# EAGLE design LED (EAGLE 6.1)
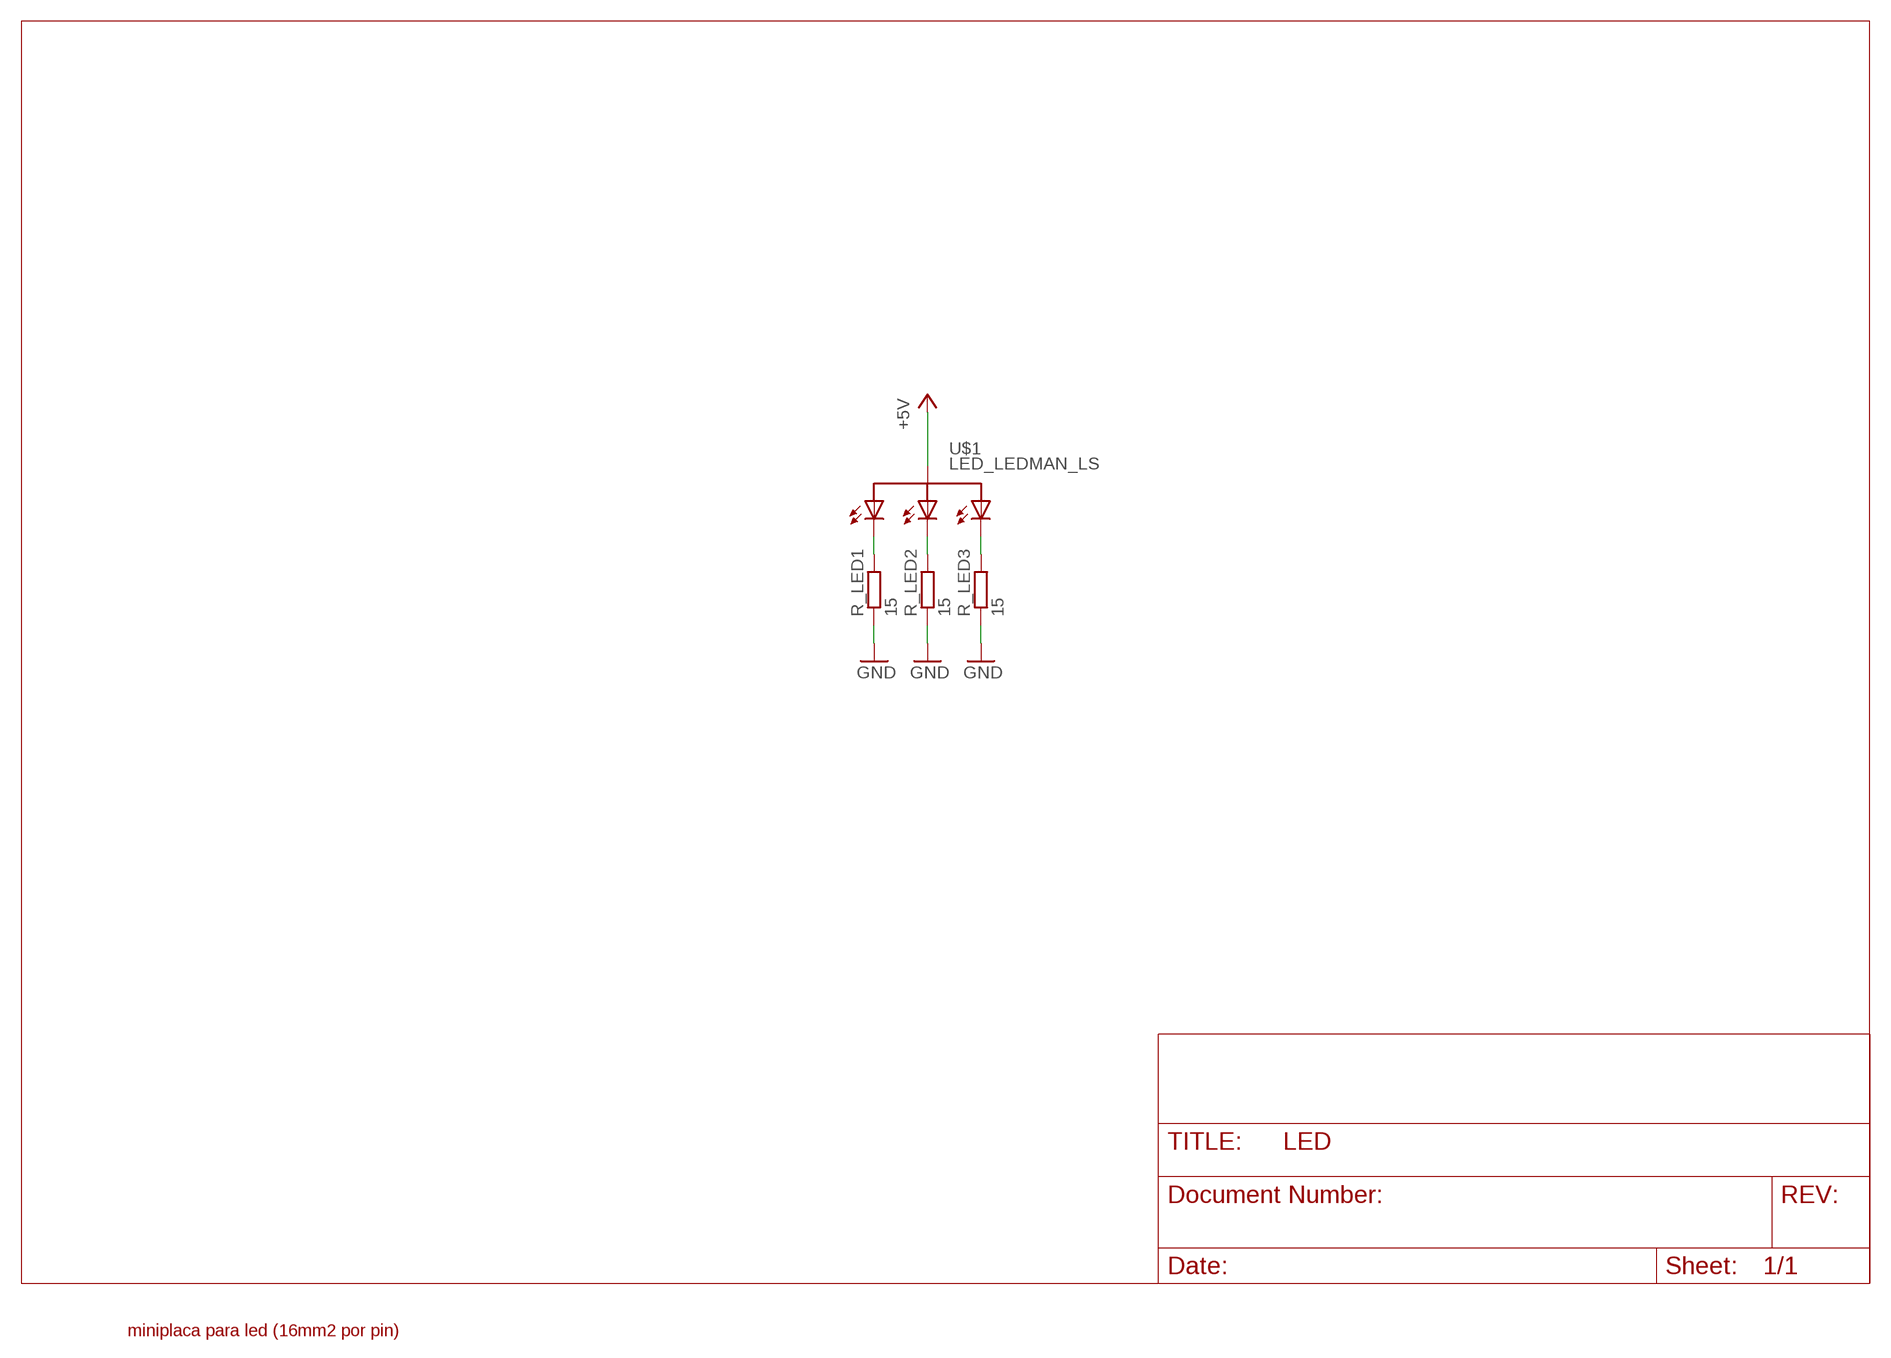
[diagram p0: schematic, sheet 1]

## Parts
R_LED1  15  R-EU_R1206  [R1206]
R_LED2  15  R-EU_R1206  [R1206]
R_LED3  15  R-EU_R1206  [R1206]
U$1  LED_LEDMAN_LS  [LED_LEDMAN_LS]

## Nets
+5V: U$1.2(ANODO)
GND: R_LED1.1 R_LED2.1 R_LED3.1
N$1: R_LED1.2 U$1.1(C1)
N$2: R_LED2.2 U$1.3(C2)
N$3: R_LED3.2 U$1.4(C3)

## Notes on the sheet
- miniplaca para led (16mm2 por pin)

## Library data of the parts
R_LED1-R_LED3 = rcl:R-EU_: RESISTOR, European symbol
U$1 = dan:LED_LEDMAN_LS

## Board
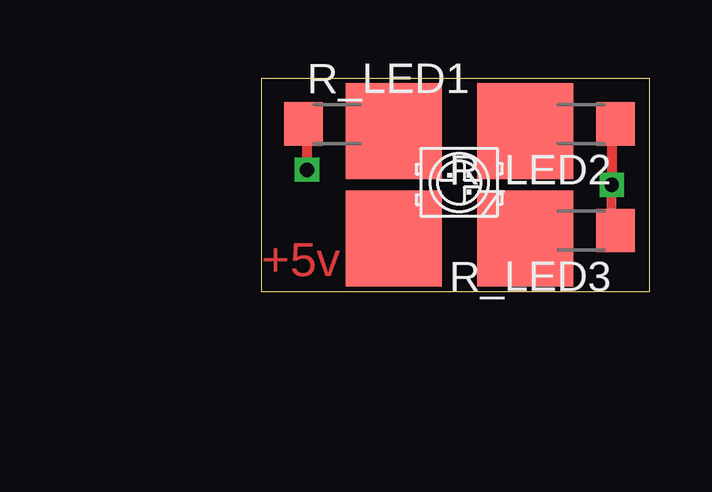
[diagram p1: board, top side]
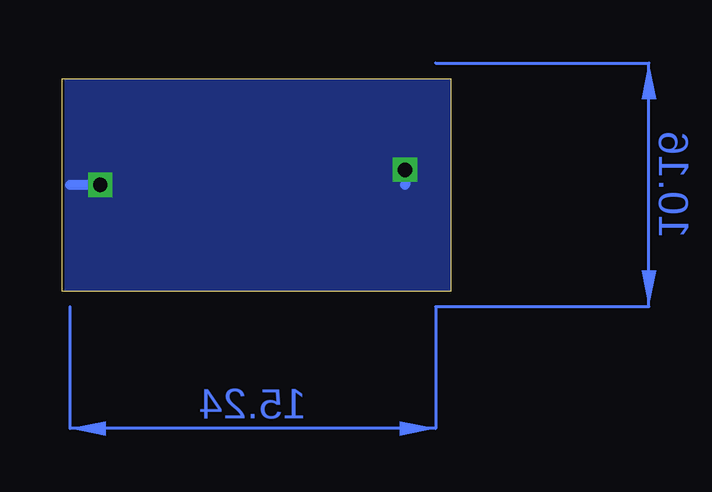
[diagram p2: board, bottom side, seen from below]

Size 16.18 x 8.88 mm. Coordinates in mm from the lower left corner, seen from the top.
Outline: 0,0 16.18,0 16.18,8.88 0,8.88 0,0
Copper layers (1*16): Top 0.035mm / dielectric 1.5mm / Bottom 0.035mm
Design rules: minimum track width 10mil, minimum drill 24mil, track to track 8mil, track to pad 8mil, pad to pad 8mil, via to via 8mil, smd to smd 8mil, copper to edge 1mil, drill to drill 8mil, minimum pad ring 10mil, minimum via ring 8mil, stop-mask expansion 4mil, vias tented up to drill 0mil, thermal gap 10mil

### Footprints (pad centres in the part's own frame; a part is rotated, then mirrored left to right if it is on the bottom)
R1206 = smd 1.6 x 1.803: 1 -1.422,0; 2 1.422,0
LED_LEDMAN_LS = smd 4 x 4: 1 -2.74,2.24; 2 -2.74,-2.24; 3 2.74,2.24; 4 2.74,-2.24

### Placement (x,y rotation side)
R_LED1  3.17,6.99 0 top
R_LED2  13.33,6.99 180 top
R_LED3  13.33,2.54 180 top
U$1  8.26,4.45 0 top

### Tracks (layer width: path | path; a pad name or v marks a point on that pad's centre or on a via)
GND  (via drill 0.6)
  Top 0.406: R_LED3.1 14.61,2.54 v14.61,4.45 14.61,6.99 R_LED2.1 | R_LED1.1 1.91,6.99 v1.91,5.08
  Bottom 0.406: v14.61,4.45 15.88,4.45 | v1.91,5.08 1.91,4.45
  pour Bottom: 0,0 15.88,0 15.88,8.89 0,8.89
N$1
  Top 0.406: R_LED1.2 5.51,6.99 | 5.71,6.99 5.51,6.99 | 5.51,6.99 U$1.1
N$2
  Top 0.406: R_LED2.2 10.99,6.99 U$1.3
N$3
  Top 0.406: R_LED3.2 10.99,2.54 U$1.4
(copper drawn outside any net)
  shapes: Bottom area x2

### Text on the board
Top: +5v